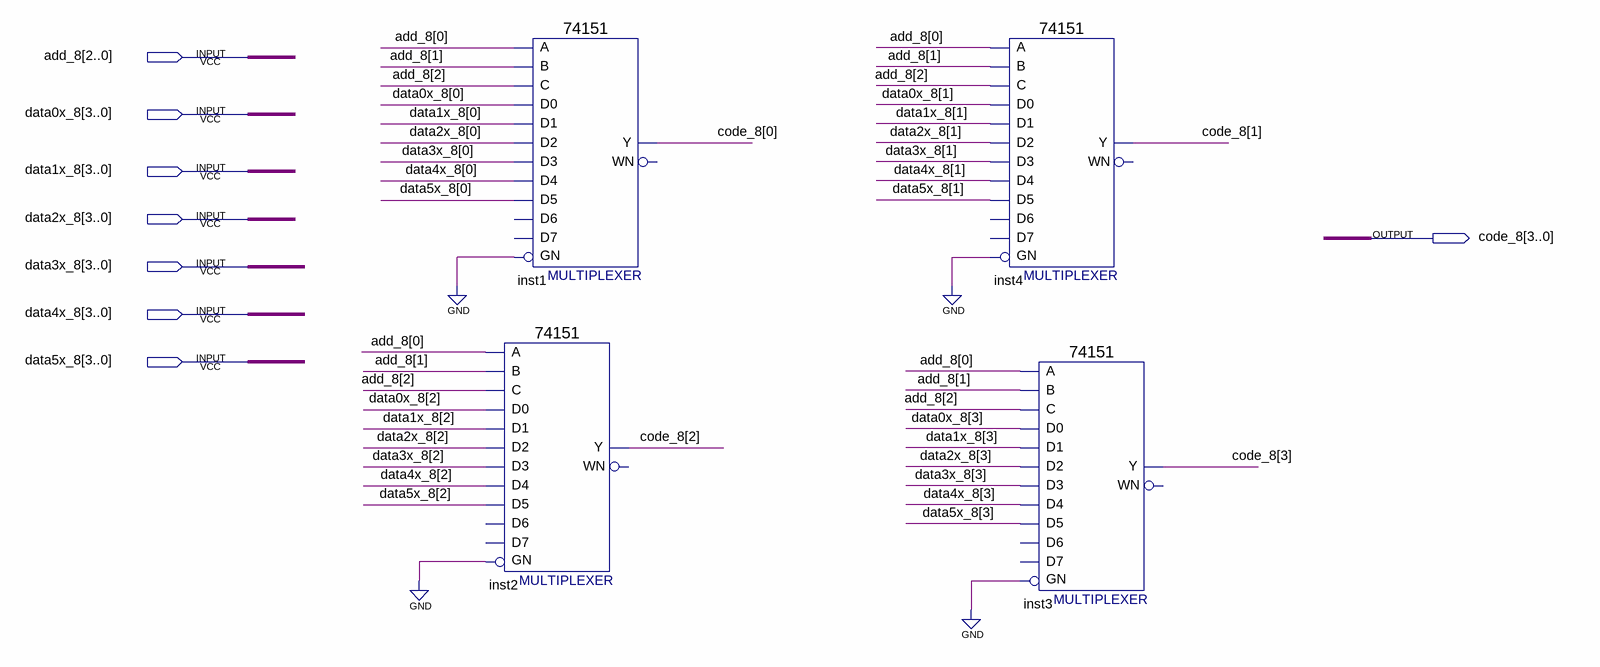
[diagram p0: schematic sheet]
// Quartus schematic code_select_8.bdf as structural Verilog: 4 symbols, 8 pins
module code_select_8 (
  input  [2:0] add_8,
  input  [3:0] data0x_8,
  input  [3:0] data1x_8,
  input  [3:0] data2x_8,
  input  [3:0] data3x_8,
  input  [3:0] data4x_8,
  input  [3:0] data5x_8,
  output [3:0] code_8
);

  \74151  inst2 (
    .GN(1'b0), .C(add_8[2]), .B(add_8[1]), .A(add_8[0]), .D5(data5x_8[2]), .D0(data0x_8[2]),
    .D1(data1x_8[2]), .D4(data4x_8[2]), .D3(data3x_8[2]), .D2(data2x_8[2]), .Y(code_8[2]));  // open: D6, D7, WN
  \74151  inst1 (
    .GN(1'b0), .C(add_8[2]), .B(add_8[1]), .A(add_8[0]), .D5(data5x_8[0]), .D0(data0x_8[0]),
    .D1(data1x_8[0]), .D4(data4x_8[0]), .D3(data3x_8[0]), .D2(data2x_8[0]), .Y(code_8[0]));  // open: D6, D7, WN
  \74151  inst4 (
    .GN(1'b0), .C(add_8[2]), .B(add_8[1]), .A(add_8[0]), .D5(data5x_8[1]), .D0(data0x_8[1]),
    .D1(data1x_8[1]), .D4(data4x_8[1]), .D3(data3x_8[1]), .D2(data2x_8[1]), .Y(code_8[1]));  // open: D6, D7, WN
  \74151  inst3 (
    .GN(1'b0), .C(add_8[2]), .B(add_8[1]), .A(add_8[0]), .D5(data5x_8[3]), .D0(data0x_8[3]),
    .D1(data1x_8[3]), .D4(data4x_8[3]), .D3(data3x_8[3]), .D2(data2x_8[3]), .Y(code_8[3]));  // open: D6, D7, WN
endmodule
